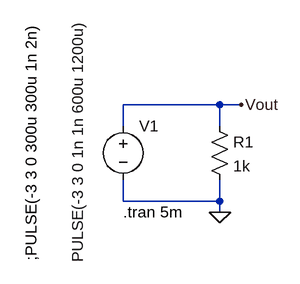
[diagram p0: schematic square_triangle_wave.asc]
square_triangle_wave.asc, the LTspice schematic file:
Version 4
SHEET 1 880 680
WIRE 240 80 96 80
WIRE 272 80 240 80
WIRE 96 112 96 80
WIRE 240 112 240 80
WIRE 96 224 96 192
WIRE 240 224 240 192
WIRE 240 224 96 224
WIRE 240 240 240 224
FLAG 240 240 0
FLAG 272 80 Vout
SYMBOL voltage 96 96 R0
WINDOW 3 -67 -140 VRight 2
WINDOW 123 0 0 Left 0
WINDOW 39 0 0 Left 0
SYMATTR InstName V1
SYMATTR Value PULSE(-3 3 0 1n 1n 600u 1200u)
SYMBOL res 224 96 R0
SYMATTR InstName R1
SYMATTR Value 1k
TEXT 96 240 Left 2 !.tran 5m
TEXT -40 -40 VRight 2 !;PULSE(-3 3 0 300u 300u 1n 2n)

The netlist it stands for:
* square_triangle_wave.asc
V1 Vout 0 PULSE(-3 3 0 1n 1n 600u 1200u)
R1 Vout 0 1k
.tran 5m
;PULSE(-3 3 0 300u 300u 1n 2n)
.backanno
.end